# EAGLE design BMX055 (EAGLE 6.6.0)
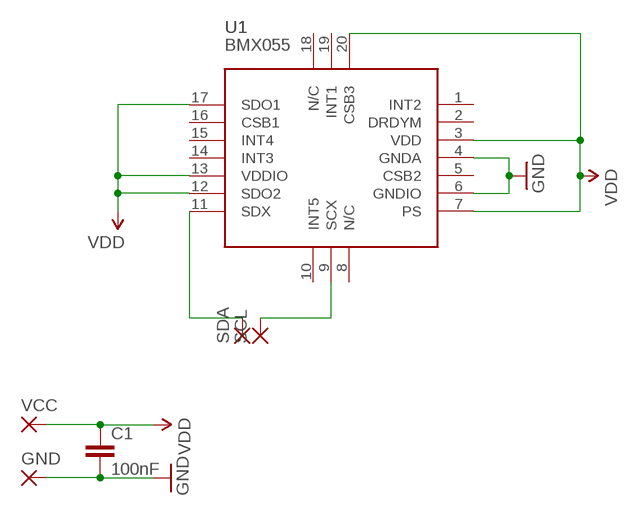
[diagram p0: schematic, sheet 1]

## Parts
C1  100nF  CAP1206  [1206]
GND  SMD2  [SMD1,27-2,54]
SCL  SMD2  [SMD1,27-2,54]
SDA  SMD2  [SMD1,27-2,54]
U1  BMX055  [BMX055]
VCC  SMD2  [SMD1,27-2,54]

## Nets
GND: C1.2 GND.1(P) U1.4(GNDA) U1.6(GNDIO)
N$1: SCL.1(P) U1.9(SCX)
N$2: SDA.1(P) U1.11(SDX)
VDD: C1.1 U1.3(VDD) U1.7(PS) U1.12(SDO2) U1.13(VDDIO) U1.17(SDO1) U1.20(CSB3) VCC.1(P)
Unconnected: U1.1(INT2) U1.2(DRDYM) U1.5(CSB2) U1.8(N/C) U1.10(INT5) U1.14(INT3) U1.15(INT4) U1.16(CSB1) U1.18(N/C) U1.19(INT1)

## Library data of the parts
C1 = SparkFun-Capacitors:CAP: Capacitor Standard 0603 ceramic capacitor, and 0.1" leaded capacitor.
GND SCL SDA VCC = wirepad:SMD2: SMD PAD
U1 = x-io:BMX055

## Board
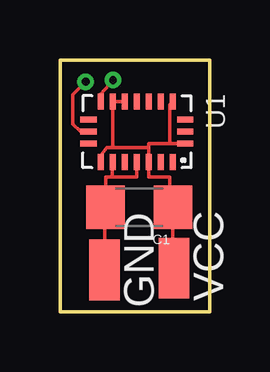
[diagram p1: board, top side]
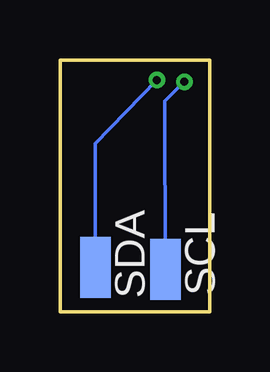
[diagram p2: board, bottom side, seen from below]

Size 6.25 x 10.52 mm. Coordinates in mm from the lower left corner, seen from the top.
Outline: 0,0 6.25,0 6.25,10.52 0,10.52 0,0
Copper layers (1*16): Top 0.0356mm / dielectric 1.5011mm / Bottom 0.0356mm
Design rules "LaenPCBOrder": minimum track width 6mil, minimum drill 13mil, track to track 6mil, track to pad 6mil, pad to pad 6mil, via to via 6mil, smd to smd 6mil, copper to edge 15mil, drill to drill 6mil, minimum pad ring 7mil, minimum via ring 7mil, stop-mask expansion 3mil, vias tented up to drill 0mil, thermal gap 10mil

### Footprints (pad centres in the part's own frame; a part is rotated, then mirrored left to right if it is on the bottom)
1206 = smd 1.6 x 1.8: 1 -1.4,0; 2 1.4,0
SMD1,27-2,54 = smd 1.27 x 2.54: 1 0,0
BMX055 = smd 0.675 x 0.25: 1 1.262,1.5; 2 1.262,1; 3 1.262,0.5; 4 1.262,0; 5 1.262,-0.5; 6 1.262,-1; 7 1.262,-1.5; 11 -1.262,-1.5; 12 -1.262,-1; 13 -1.262,-0.5; 14 -1.262,0; 15 -1.262,0.5; 16 -1.262,1; 17 -1.262,1.5 | smd 0.25 x 0.675: 8 0.5,-2.013; 9 0,-2.013; 10 -0.5,-2.013; 18 -0.5,2.013; 19 0,2.013; 20 0.5,2.013

### Placement (x,y rotation side)
C1  3.3,4.37 180 top
GND  1.85,1.75 180 top
SCL  1.85,1.78 180 bottom
SDA  4.78,1.85 180 bottom
U1  3.2,7.52 270 top
VCC  4.75,1.83 180 top

### Tracks (layer width: path | path; a pad name or v marks a point on that pad's centre or on a via)
GND
  Top 0.152: U1.4 3.2,5.64 2.18,5.64 | 2.18,5.64 2.18,6.26 U1.6 | 2.18,5.64 1.9,5.64 C1.2 1.85,4.37 GND.1
  Top 0.254: 2.03,4.37 C1.2
N$1  (via drill 0.33)
  Top 0.152: U1.9 0.86,7.52 0.53,7.85 0.53,9.07 v1.07,9.6
  Bottom 0.152: v1.07,9.6 1.88,8.79 SCL.1
N$2  (via drill 0.33)
  Top 0.152: U1.11 1.7,9.09 v2.21,9.68
  Bottom 0.152: v2.21,9.68 4.78,7.04 SDA.1
VDD
  Top 0.152: U1.13 U1.12 2.2,6.86 | U1.7 1.7,6.53 1.96,6.86 2.2,6.86 | 3.7,6.86 2.2,6.86 | 3.7,6.86 U1.3 3.7,5.64 4.57,5.64 4.57,4.37 | U1.20 4.57,7.02 | 4.57,7.02 3.7,7.02 3.7,6.86 | U1.17 4.57,8.65 4.57,7.02 | C1.1 4.7,1.88 VCC.1
  Top 0.254: 4.57,4.37 C1.1